# Altium schematic sheet A1-A1 Active Bias.SchDoc: A1-A1 Active Bias
size D; DrawnBy: C. Lewis; Engineer: C. Lewis; Address1: 4650 NORRIS CANYON RD.; Address2: SAN RAMON, CA 94583; DocumentNumber: 35133; Revision: D; SheetNumber: 4; SheetTotal: 20; PageSetup: Record=PageOptions|CenterHorizontal=True|CenterVertical=True|PrintScale=0.51|XCorrection=1.00|YCorrection=1.00|PrintKind=1|BorderSize=5000000|LeftOffset=0|BottomOffset=0|Orientation=2|PaperLength=1000|PaperWidth=1000|Scale=100|PaperSource=262|PrintQuality=600|MediaType=1|DitherType=10|PaperKind=11x17|PrintScaleMode=1
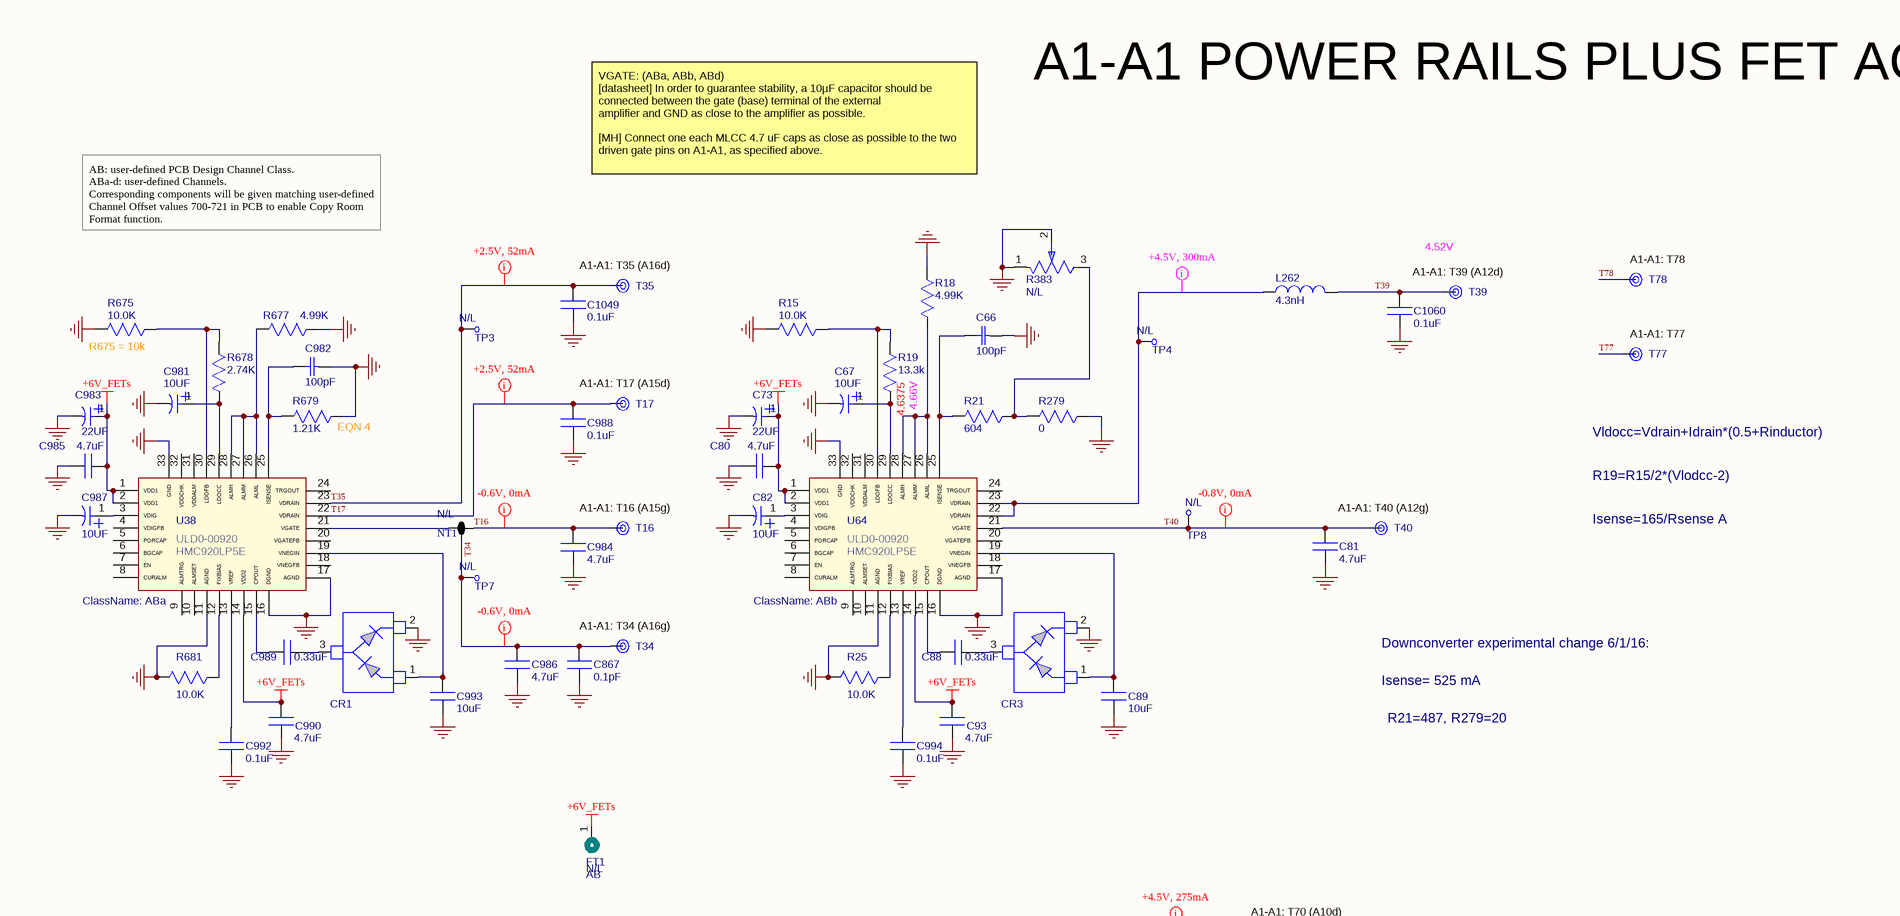
[diagram p0: A1-A1 Active Bias.SchDoc, top left]
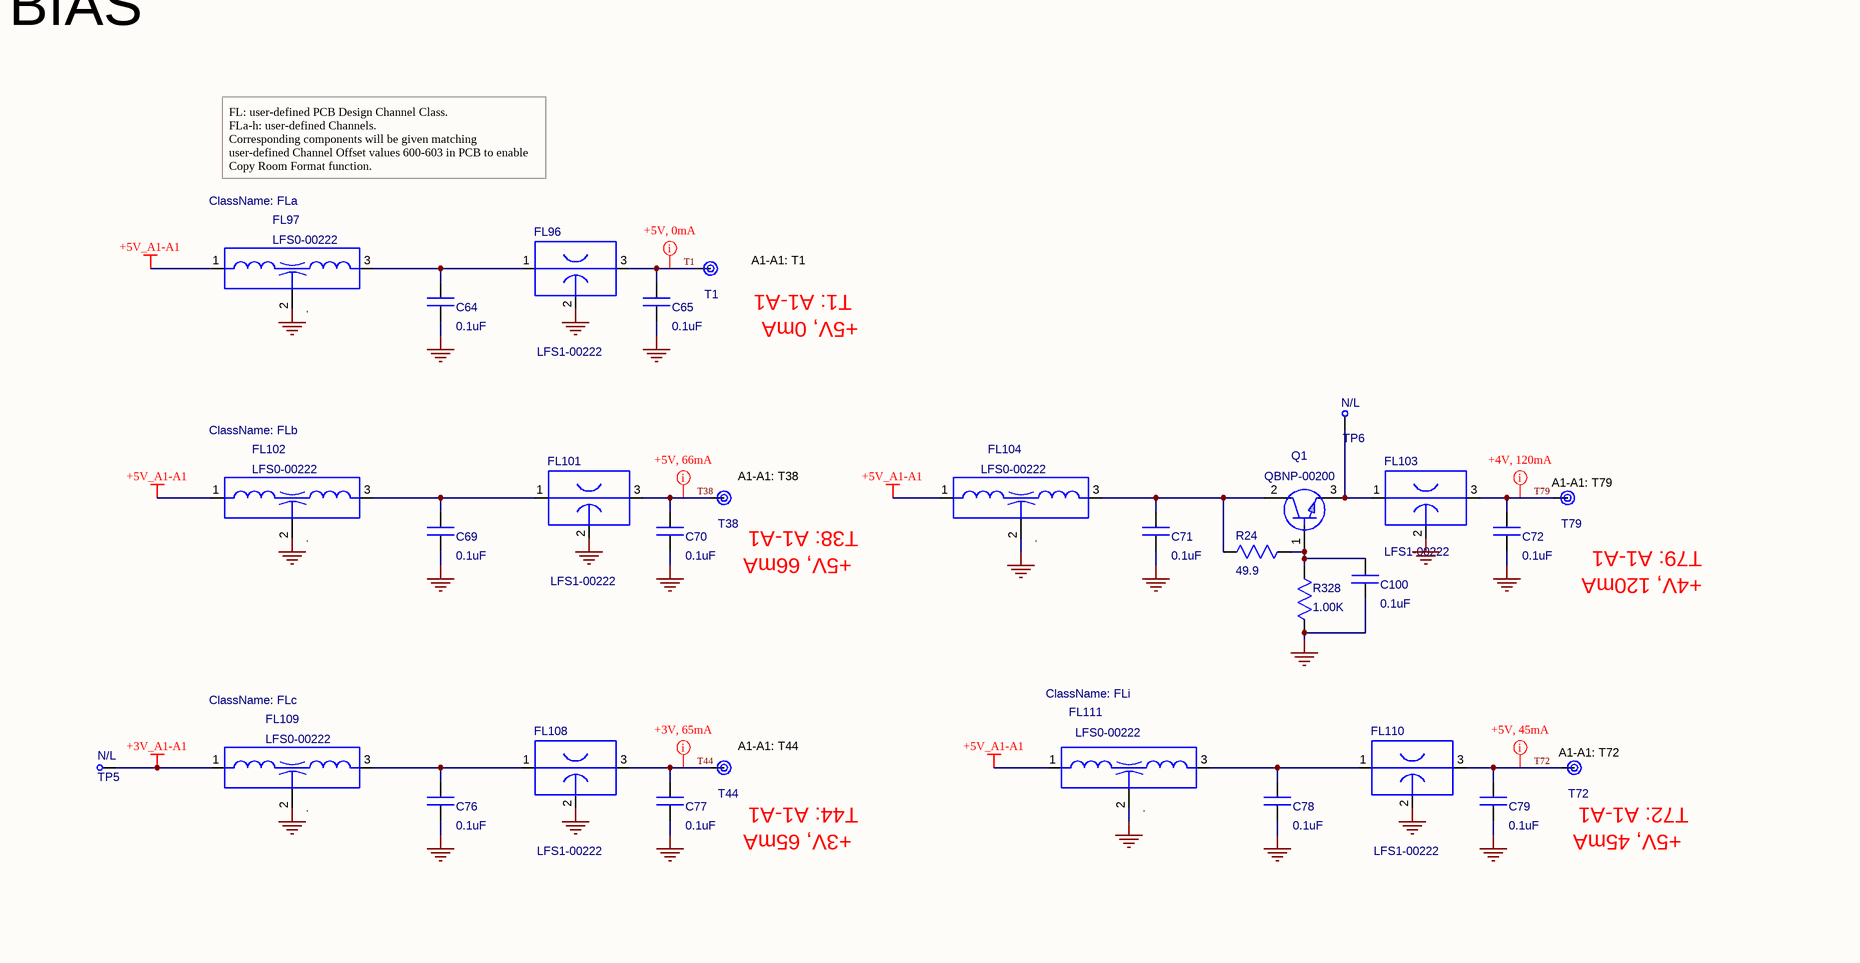
[diagram p1: A1-A1 Active Bias.SchDoc, top right]
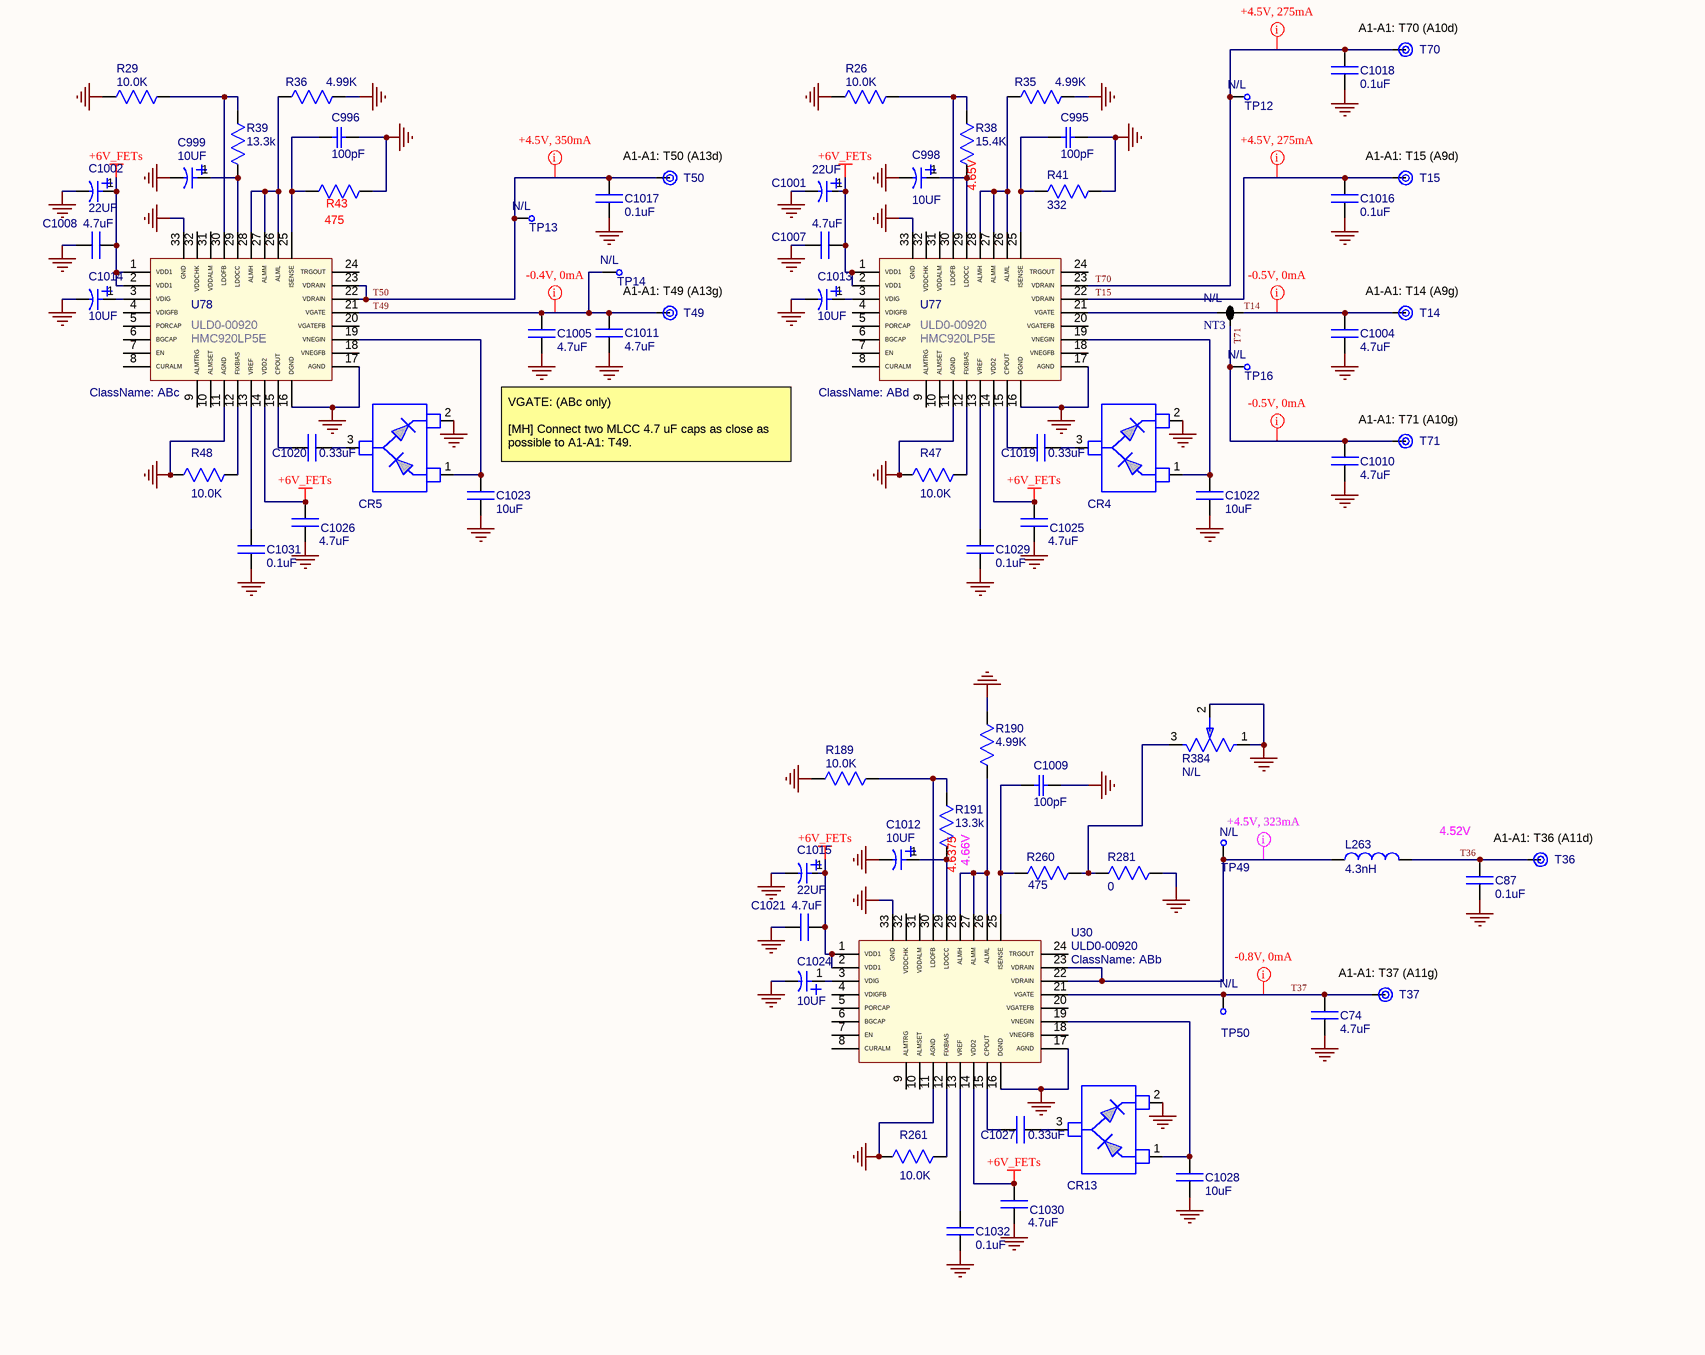
[diagram p2: A1-A1 Active Bias.SchDoc, bottom left]
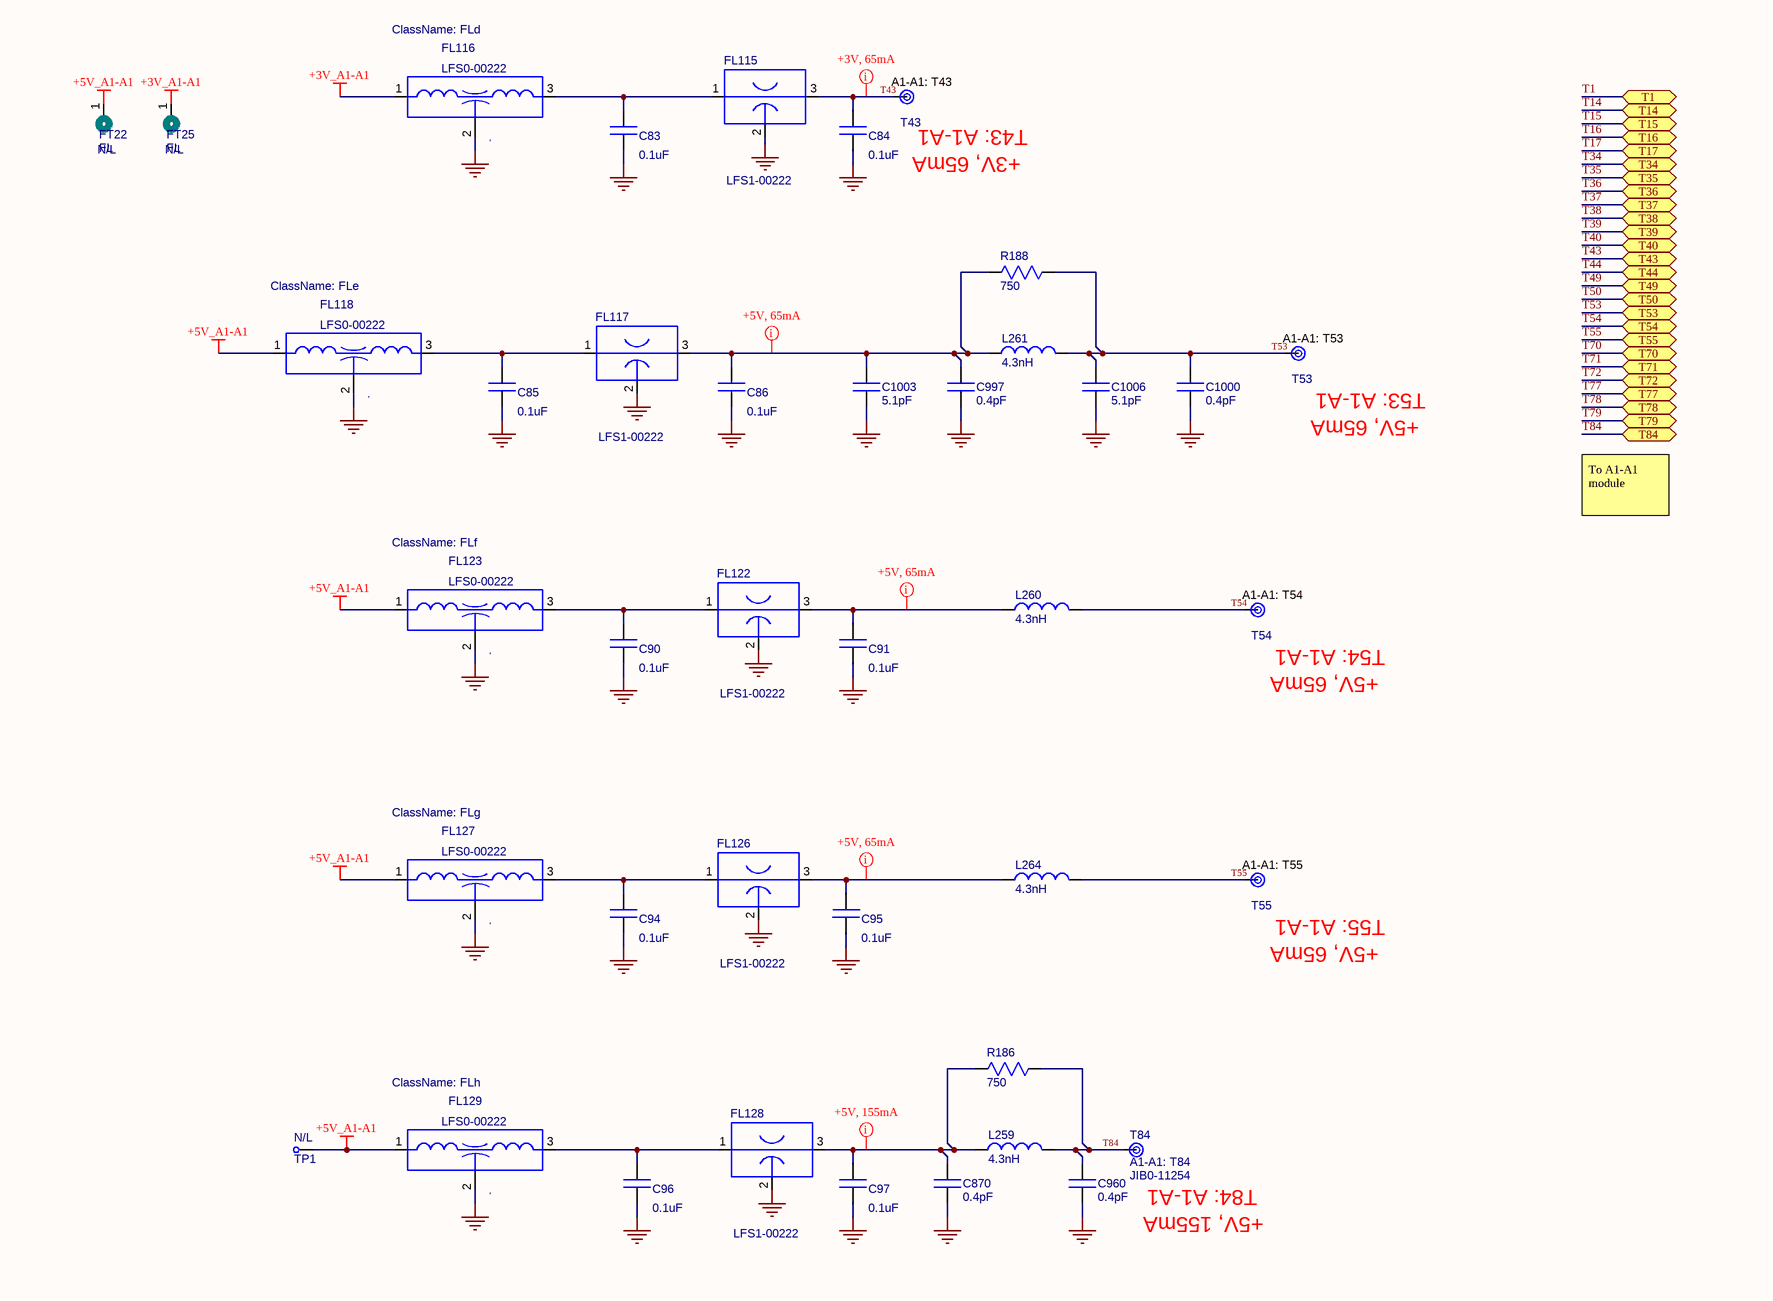
[diagram p3: A1-A1 Active Bias.SchDoc, bottom right]

## Parts
C64  value 0.1uF  [CAP-0603-H035-N]  (hidden comment: .1UF;10%;X7R;16V;CHIP;0603)
C65  value 0.1uF  [CAP-0603-H035-N]  (hidden comment: .1UF;10%;X7R;16V;CHIP;0603)
C66  value 100pF  [CC0603-P]  (hidden comment: CK45-01100[RF])
C67  10UF  [CAPP-3216-18]
C69  value 0.1uF  [CAP-0603-H035-N]  (hidden comment: .1UF;10%;X7R;16V;CHIP;0603)
C70  value 0.1uF  [CAP-0603-H035-N]  (hidden comment: .1UF;10%;X7R;16V;CHIP;0603)
C71  value 0.1uF  [CAP-0603-H035-N]  (hidden comment: .1UF;10%;X7R;16V;CHIP;0603)
C72  value 0.1uF  [CAP-0603-H035-N]  (hidden comment: .1UF;10%;X7R;16V;CHIP;0603)
C73  22UF  [CAPP-7343-31-N]
C74  value 4.7uF  [CAP-0402-N]  (hidden comment: 4.7 uF,10%;X5R;6.3V,CHIP;0402)
C76  value 0.1uF  [CAP-0603-H035-N]  (hidden comment: .1UF;10%;X7R;16V;CHIP;0603)
C77  value 0.1uF  [CAP-0603-H035-N]  (hidden comment: .1UF;10%;X7R;16V;CHIP;0603)
C78  value 0.1uF  [CAP-0603-H035-N]  (hidden comment: .1UF;10%;X7R;16V;CHIP;0603)
C79  value 0.1uF  [CAP-0603-H035-N]  (hidden comment: .1UF;10%;X7R;16V;CHIP;0603)
C80  value 4.7uF  [CAP-0805-N]  (hidden comment: 4.7uF 25V X5R CHIP CERAMIC)
C81  value 4.7uF  [CAP-0402-N]  (hidden comment: 4.7 uF,10%;X5R;6.3V,CHIP;0402)
C82  10UF  [CAPP-3216-18]
C83  value 0.1uF  [CAP-0603-H035-N]  (hidden comment: .1UF;10%;X7R;16V;CHIP;0603)
C84  value 0.1uF  [CAP-0603-H035-N]  (hidden comment: .1UF;10%;X7R;16V;CHIP;0603)
C85  value 0.1uF  [CAP-0603-H035-N]  (hidden comment: .1UF;10%;X7R;16V;CHIP;0603)
C86  value 0.1uF  [CAP-0603-H035-N]  (hidden comment: .1UF;10%;X7R;16V;CHIP;0603)
C87  value 0.1uF  [CAP-0603-H035-N]  (hidden comment: .1UF;10%;X7R;16V;CHIP;0603)
C88  value 0.33uF  [CAP-0805-N]  (hidden comment: .33 UF X7R CHIP CERAMIC)
C89  value 10uF  [CAP-0805-N]  (hidden comment: 10uF 16V X5R CHIP CERAMIC)
C90  value 0.1uF  [CAP-0603-H035-N]  (hidden comment: .1UF;10%;X7R;16V;CHIP;0603)
C91  value 0.1uF  [CAP-0603-H035-N]  (hidden comment: .1UF;10%;X7R;16V;CHIP;0603)
C93  value 4.7uF  [CAP-0805-N]  (hidden comment: 4.7uF 25V X5R CHIP CERAMIC)
C94  value 0.1uF  [CAP-0603-H035-N]  (hidden comment: .1UF;10%;X7R;16V;CHIP;0603)
C95  value 0.1uF  [CAP-0603-H035-N]  (hidden comment: .1UF;10%;X7R;16V;CHIP;0603)
C96  value 0.1uF  [CAP-0603-H035-N]  (hidden comment: .1UF;10%;X7R;16V;CHIP;0603)
C97  value 0.1uF  [CAP-0603-H035-N]  (hidden comment: .1UF;10%;X7R;16V;CHIP;0603)
C100  value 0.1uF  [CAP-0603-H035-N]  (hidden comment: .1UF;10%;X7R;16V;CHIP;0603)
C867  value 0.1pF  [CAP-0402-N]  (hidden comment: .1 PF;200V;.05PF;HIGH Q;SMT;CERAMIC;0402)
C870  value 0.4pF  [CAP-0402-RF]  (hidden comment: .4 PF;200V;.05PF;HIGH Q;SMT;CERAMIC;0402)
C960  value 0.4pF  [CAP-0402-RF]  (hidden comment: .4 PF;200V;.05PF;HIGH Q;SMT;CERAMIC;0402)
C981  10UF  [CAPP-3216-18]
C982  value 100pF  [CC0603-P]  (hidden comment: CK45-01100[RF])
C983  22UF  [CAPP-7343-31-N]
C984  value 4.7uF  [CAP-0402-N]  (hidden comment: 4.7 uF,10%;X5R;6.3V,CHIP;0402)
C985  value 4.7uF  [CAP-0805-N]  (hidden comment: 4.7uF 25V X5R CHIP CERAMIC)
C986  value 4.7uF  [CAP-0402-N]  (hidden comment: 4.7 uF,10%;X5R;6.3V,CHIP;0402)
C987  10UF  [CAPP-3216-18]
C988  value 0.1uF  [CAP-0603-H035-N]  (hidden comment: .1UF;10%;X7R;16V;CHIP;0603)
C989  value 0.33uF  [CAP-0805-N]  (hidden comment: .33 UF X7R CHIP CERAMIC)
C990  value 4.7uF  [CAP-0805-N]  (hidden comment: 4.7uF 25V X5R CHIP CERAMIC)
C992  value 0.1uF  [CAP-0603-H035-N]  (hidden comment: .1UF;10%;X7R;16V;CHIP;0603)
C993  value 10uF  [CAP-0805-N]  (hidden comment: 10uF 16V X5R CHIP CERAMIC)
C994  value 0.1uF  [CAP-0603-H035-N]  (hidden comment: .1UF;10%;X7R;16V;CHIP;0603)
C995  value 100pF  [CC0603-P]  (hidden comment: CK45-01100[RF])
C996  value 100pF  [CC0603-P]  (hidden comment: CK45-01100[RF])
C997  value 0.4pF  [CAP-0402-RF]  (hidden comment: .4 PF;200V;.05PF;HIGH Q;SMT;CERAMIC;0402)
C998  10UF  [CAPP-3216-18]
C999  10UF  [CAPP-3216-18]
C1000  value 0.4pF  [CAP-0402-RF]  (hidden comment: .4 PF;200V;.05PF;HIGH Q;SMT;CERAMIC;0402)
C1001  22UF  [CAPP-7343-31-N]
C1002  22UF  [CAPP-7343-31-N]
C1003  value 5.1pF  [CAP-0402-RF]  (hidden comment: 5.1 PF;200V;.1PF;HIGH Q;SMT;CERAMIC;0402)
C1004  value 4.7uF  [CAP-0402-N]  (hidden comment: 4.7 uF,10%;X5R;6.3V,CHIP;0402)
C1005  value 4.7uF  [CAP-0402-N]  (hidden comment: 4.7 uF,10%;X5R;6.3V,CHIP;0402)
C1006  value 5.1pF  [CAP-0402-RF]  (hidden comment: 5.1 PF;200V;.1PF;HIGH Q;SMT;CERAMIC;0402)
C1007  value 4.7uF  [CAP-0805-N]  (hidden comment: 4.7uF 25V X5R CHIP CERAMIC)
C1008  value 4.7uF  [CAP-0805-N]  (hidden comment: 4.7uF 25V X5R CHIP CERAMIC)
C1009  value 100pF  [CC0603-P]  (hidden comment: CK45-01100[RF])
C1010  value 4.7uF  [CAP-0402-N]  (hidden comment: 4.7 uF,10%;X5R;6.3V,CHIP;0402)
C1011  value 4.7uF  [CAP-0402-N]  (hidden comment: 4.7 uF,10%;X5R;6.3V,CHIP;0402)
C1012  10UF  [CAPP-3216-18]
C1013  10UF  [CAPP-3216-18]
C1014  10UF  [CAPP-3216-18]
C1015  22UF  [CAPP-7343-31-N]
C1016  value 0.1uF  [CAP-0603-H035-N]  (hidden comment: .1UF;10%;X7R;16V;CHIP;0603)
C1017  value 0.1uF  [CAP-0603-H035-N]  (hidden comment: .1UF;10%;X7R;16V;CHIP;0603)
C1018  value 0.1uF  [CAP-0603-H035-N]  (hidden comment: .1UF;10%;X7R;16V;CHIP;0603)
C1019  value 0.33uF  [CAP-0805-N]  (hidden comment: .33 UF X7R CHIP CERAMIC)
C1020  value 0.33uF  [CAP-0805-N]  (hidden comment: .33 UF X7R CHIP CERAMIC)
C1021  value 4.7uF  [CAP-0805-N]  (hidden comment: 4.7uF 25V X5R CHIP CERAMIC)
C1022  value 10uF  [CAP-0805-N]  (hidden comment: 10uF 16V X5R CHIP CERAMIC)
C1023  value 10uF  [CAP-0805-N]  (hidden comment: 10uF 16V X5R CHIP CERAMIC)
C1024  10UF  [CAPP-3216-18]
C1025  value 4.7uF  [CAP-0805-N]  (hidden comment: 4.7uF 25V X5R CHIP CERAMIC)
C1026  value 4.7uF  [CAP-0805-N]  (hidden comment: 4.7uF 25V X5R CHIP CERAMIC)
C1027  value 0.33uF  [CAP-0805-N]  (hidden comment: .33 UF X7R CHIP CERAMIC)
C1028  value 10uF  [CAP-0805-N]  (hidden comment: 10uF 16V X5R CHIP CERAMIC)
C1029  value 0.1uF  [CAP-0603-H035-N]  (hidden comment: .1UF;10%;X7R;16V;CHIP;0603)
C1030  value 4.7uF  [CAP-0805-N]  (hidden comment: 4.7uF 25V X5R CHIP CERAMIC)
C1031  value 0.1uF  [CAP-0603-H035-N]  (hidden comment: .1UF;10%;X7R;16V;CHIP;0603)
C1032  value 0.1uF  [CAP-0603-H035-N]  (hidden comment: .1UF;10%;X7R;16V;CHIP;0603)
C1049  value 0.1uF  [CAP-0603-H035-N]  (hidden comment: .1UF;10%;X7R;16V;CHIP;0603)
C1060  value 0.1uF  [CAP-0603-H035-N]  (hidden comment: .1UF;10%;X7R;16V;CHIP;0603)
CR1  Diode;Dual;Schottky;.4VF@10MA;5NS;SOT23  [SOT23-N]  (value not drawn)
CR3  Diode;Dual;Schottky;.4VF@10MA;5NS;SOT23  [SOT23-N]  (value not drawn)
CR4  Diode;Dual;Schottky;.4VF@10MA;5NS;SOT23  [SOT23-N]  (value not drawn)
CR5  Diode;Dual;Schottky;.4VF@10MA;5NS;SOT23  [SOT23-N]  (value not drawn)
CR13  Diode;Dual;Schottky;.4VF@10MA;5NS;SOT23  [SOT23-N]  (value not drawn)
FL96  NFM18CC222R1C3  [FIL-NFL18C]  (value not drawn)
FL97  ClassName: FLa  [FIL-NFE31P-1206-4P]  (hidden comment: Filter EMI 2200PF,1206)
FL101  NFM18CC222R1C3  [FIL-NFL18C]  (value not drawn)
FL102  ClassName: FLb  [FIL-NFE31P-1206-4P]  (hidden comment: Filter EMI 2200PF,1206)
FL103  NFM18CC222R1C3  [FIL-NFL18C]  (value not drawn)
FL104  Filter EMI 2200PF,1206  [FIL-NFE31P-1206-4P]  (value not drawn)
FL108  NFM18CC222R1C3  [FIL-NFL18C]  (value not drawn)
FL109  ClassName: FLc  [FIL-NFE31P-1206-4P]  (hidden comment: Filter EMI 2200PF,1206)
FL110  NFM18CC222R1C3  [FIL-NFL18C]  (value not drawn)
FL111  ClassName: FLi  [FIL-NFE31P-1206-4P]  (hidden comment: Filter EMI 2200PF,1206)
FL115  NFM18CC222R1C3  [FIL-NFL18C]  (value not drawn)
FL116  ClassName: FLd  [FIL-NFE31P-1206-4P]  (hidden comment: Filter EMI 2200PF,1206)
FL117  NFM18CC222R1C3  [FIL-NFL18C]  (value not drawn)
FL118  ClassName: FLe  [FIL-NFE31P-1206-4P]  (hidden comment: Filter EMI 2200PF,1206)
FL122  NFM18CC222R1C3  [FIL-NFL18C]  (value not drawn)
FL123  ClassName: FLf  [FIL-NFE31P-1206-4P]  (hidden comment: Filter EMI 2200PF,1206)
FL126  NFM18CC222R1C3  [FIL-NFL18C]  (value not drawn)
FL127  ClassName: FLg  [FIL-NFE31P-1206-4P]  (hidden comment: Filter EMI 2200PF,1206)
FL128  NFM18CC222R1C3  [FIL-NFL18C]  (value not drawn)
FL129  ClassName: FLh  [FIL-NFE31P-1206-4P]  (hidden comment: Filter EMI 2200PF,1206)
FT1  AB  NoLoad: N/L  [FromToNode_ML2]  (net tie, no BOM)
FT22  FL  NoLoad: N/L  [FromToNode_ML2]  (net tie, no BOM)
FT25  FL  NoLoad: N/L  [FromToNode_ML2]  (net tie, no BOM)
L259  value 4.3nH  [IND-0402HP]  (hidden comment: INDUCTOR;4.3NH;2%;7.15GHZ SRF;90Q @1.7GHZ;.050 DCR;1.6A;0402)
L260  value 4.3nH  [IND-0402HP]  (hidden comment: INDUCTOR;4.3NH;2%;7.15GHZ SRF;90Q @1.7GHZ;.050 DCR;1.6A;0402)
L261  value 4.3nH  [IND-0402HP]  (hidden comment: INDUCTOR;4.3NH;2%;7.15GHZ SRF;90Q @1.7GHZ;.050 DCR;1.6A;0402)
L262  value 4.3nH  [IND-0402HP]  (hidden comment: INDUCTOR;4.3NH;2%;7.15GHZ SRF;90Q @1.7GHZ;.050 DCR;1.6A;0402)
L263  value 4.3nH  [IND-0402HP]  (hidden comment: INDUCTOR;4.3NH;2%;7.15GHZ SRF;90Q @1.7GHZ;.050 DCR;1.6A;0402)
L264  value 4.3nH  [IND-0402HP]  (hidden comment: INDUCTOR;4.3NH;2%;7.15GHZ SRF;90Q @1.7GHZ;.050 DCR;1.6A;0402)
NT1  NoLoad: N/L  [3wayT_LP]  (hidden comment: 3 way net tie junction T shape)  (net tie, no BOM)
NT3  NoLoad: N/L  [3wayT_LP]  (hidden comment: 3 way net tie junction T shape)  (net tie, no BOM)
Q1  5A;25V VCEO;12.5W;45 MIN HFE;DPAK  [TO-252_DPAK_REVA]  (value not drawn)
R15  value 10.0K  [RES-0402-N]  (hidden comment: 10.0K OHMS;.06W;1%;200PPM;FILM;CHIP;0402)
R18  value 4.99K  [RES-0402-N]  (hidden comment: 4.99K OHMS;.06W;1%;200PPM;FILM;CHIP;0402)
R19  value 13.3k  [RES-0402-N]  (hidden comment: 13.3K OHMS;.06W;1%;200PPM;FILM;CHIP;0402)
R21  value 604  [RES-0402-N]  (hidden comment: 604 OHMS; 1%; .1W; 100PPM; FILM; CHIP; 0402)
R24  value 49.9  [RES-0603-N]  (hidden comment: 49.9 OHMS; 1%; .1W; 100PPM; FILM; CHIP; 0603)
R25  value 10.0K  [RES-0402-N]  (hidden comment: 10.0K Ohms;.06W;0.5%;±50PPM;CHIP RES;0402)
R26  value 10.0K  [RES-0402-N]  (hidden comment: 10.0K OHMS;.06W;1%;200PPM;FILM;CHIP;0402)
R29  value 10.0K  [RES-0402-N]  (hidden comment: 10.0K OHMS;.06W;1%;200PPM;FILM;CHIP;0402)
R35  value 4.99K  [RES-0402-N]  (hidden comment: 4.99K OHMS;.06W;1%;200PPM;FILM;CHIP;0402)
R36  value 4.99K  [RES-0402-N]  (hidden comment: 4.99K OHMS;.06W;1%;200PPM;FILM;CHIP;0402)
R38  value 15.4K  [RES-0402-N]  (hidden comment: 15.4K OHMS;.06W;1%;200PPM;FILM;CHIP;0402)
R39  value 13.3k  [RES-0402-N]  (hidden comment: 13.3K OHMS;.06W;1%;200PPM;FILM;CHIP;0402)
R41  value 332  [RES-0402-N]  (hidden comment: 332 OHMS; 1%; .1W; 100PPM; FILM; CHIP)
R43  value 475  [RES-0402-N]  (hidden comment: 475 OHMS; 1%; .1W; 100PPM; FILM; CHIP; 0402)
R47  value 10.0K  [RES-0402-N]  (hidden comment: 10.0K Ohms;.06W;0.5%;±50PPM;CHIP RES;0402)
R48  value 10.0K  [RES-0402-N]  (hidden comment: 10.0K Ohms;.06W;0.5%;±50PPM;CHIP RES;0402)
R186  value 750  [RES-0201-N]  (hidden comment: 750 OHMS;.05W;1%;100PPM;FILM CHIP;0201)
R188  value 750  [RES-0201-N]  (hidden comment: 750 OHMS;.05W;1%;100PPM;FILM CHIP;0201)
R189  value 10.0K  [RES-0402-N]  (hidden comment: 10.0K OHMS;.06W;1%;200PPM;FILM;CHIP;0402)
R190  value 4.99K  [RES-0402-N]  (hidden comment: 4.99K OHMS;.06W;1%;200PPM;FILM;CHIP;0402)
R191  value 13.3k  [RES-0402-N]  (hidden comment: 13.3K OHMS;.06W;1%;200PPM;FILM;CHIP;0402)
R260  value 475  [RES-0402-N]  (hidden comment: 475 OHMS; 1%; .1W; 100PPM; FILM; CHIP; 0402)
R261  value 10.0K  [RES-0402-N]  (hidden comment: 10.0K Ohms;.06W;0.5%;±50PPM;CHIP RES;0402)
R279  value 0  [RES-0402-N]  (hidden comment: JUMPER;0 OHMS;SMT;0402)
R281  value 0  [RES-0402-N]  (hidden comment: JUMPER;0 OHMS;SMT;0402)
R328  value 1.00K  [RES-0402-N]  (hidden comment: 1.0K OHMS;.06W;1%;200PPM;FILM;CHIP;0402)
R383  NoLoad: N/L  [TRIM-PVA2]  (hidden comment: 220 OHM; 25%; 1T; SMT; 2.75MMx2.2MM; TOP ADJ)
R384  NoLoad: N/L  [TRIM-PVA2]  (hidden comment: 220 OHM; 25%; 1T; SMT; 2.75MMx2.2MM; TOP ADJ)
R675  value 10.0K  [RES-0402-N]  (hidden comment: 10.0K OHMS;.06W;1%;200PPM;FILM;CHIP;0402)
R677  value 4.99K  [RES-0402-N]  (hidden comment: 4.99K OHMS;.06W;1%;200PPM;FILM;CHIP;0402)
R678  value 2.74K  [RES-0402-N]  (hidden comment: 2.74K OHMS;.06W;1%;100PPM;FILM;CHIP;0402)
R679  value 1.21K  [RES-0402-N]  (hidden comment: 1.21K OHMS;.06W;1%;200PPM;FILM;CHIP;0402)
R681  value 10.0K  [RES-0402-N]  (hidden comment: 10.0K Ohms;.06W;0.5%;±50PPM;CHIP RES;0402)
T1  A1-A1: T1  [JIB0-11254]
T14  A1-A1: T14 (A9g)  [JIB0-11254]
T15  A1-A1: T15 (A9d)  [JIB0-11254]
T16  A1-A1: T16 (A15g)  [JIB0-11254]
T17  A1-A1: T17 (A15d)  [JIB0-11254]
T34  A1-A1: T34 (A16g)  [JIB0-11254]
T35  A1-A1: T35 (A16d)  [JIB0-11254]
T36  A1-A1: T36 (A11d)  [JIB0-11254]
T37  A1-A1: T37 (A11g)  [JIB0-11254]
T38  A1-A1: T38  [JIB0-11254]
T39  A1-A1: T39 (A12d)  [JIB0-11254]
T40  A1-A1: T40 (A12g)  [JIB0-11254]
T43  A1-A1: T43  [JIB0-11254]
T44  A1-A1: T44  [JIB0-11254]
T49  A1-A1: T49 (A13g)  [JIB0-11254]
T50  A1-A1: T50 (A13d)  [JIB0-11254]
T53  A1-A1: T53  [JIB0-11254]
T54  A1-A1: T54  [JIB0-11254]
T55  A1-A1: T55  [JIB0-11254]
T70  A1-A1: T70 (A10d)  [JIB0-11254]
T71  A1-A1: T71 (A10g)  [JIB0-11254]
T72  A1-A1: T72  [JIB0-11254]
T77  A1-A1: T77  [JIB0-11254]
T78  A1-A1: T78  [JIB0-11254]
T79  A1-A1: T79  [JIB0-11254]
T84  A1-A1: T84  G_PN: JIB0-11254  [JIB0-11254-TRIM]
TP1  NoLoad: N/L  [TP-060]  (hidden comment: .)
TP3  NoLoad: N/L  [TP-060]  (hidden comment: .)
TP4  NoLoad: N/L  [TP-060]  (hidden comment: .)
TP5  NoLoad: N/L  [TP-060]  (hidden comment: .)
TP6  NoLoad: N/L  [TP-060]  (hidden comment: .)
TP7  NoLoad: N/L  [TP-060]  (hidden comment: .)
TP8  NoLoad: N/L  [TP-060]  (hidden comment: .)
TP12  NoLoad: N/L  [TP-060]  (hidden comment: .)
TP13  NoLoad: N/L  [TP-060]  (hidden comment: .)
TP14  NoLoad: N/L  [TP-060]  (hidden comment: .)
TP16  NoLoad: N/L  [TP-060]  (hidden comment: .)
TP49  NoLoad: N/L  [TP-060]  (hidden comment: .)
TP50  NoLoad: N/L  [TP-060]  (hidden comment: .)
U30  G_PN: ULD0-00920  ClassName: ABb  [LP5E_HITTITE_NO_VIAS]  (hidden comment: ULD0-00920_1)
U38  M_PN: HMC920LP5E  ClassName: ABa  [LP5E_HITTITE]  (hidden comment: ULD0-00920)
U64  M_PN: HMC920LP5E  ClassName: ABb  [LP5E_HITTITE]  (hidden comment: ULD0-00920)
U77  M_PN: HMC920LP5E  ClassName: ABd  [LP5E_HITTITE]  (hidden comment: ULD0-00920)
U78  M_PN: HMC920LP5E  ClassName: ABc  [LP5E_HITTITE]  (hidden comment: ULD0-00920)

## Ports
T1, T14, T15, T16, T17, T34, T35, T36, T37, T38, T39, T40, T43, T44, T49, T50, T53, T54, T55, T70, T71, T72, T77, T78, T79, T84

## Nets
+3V_A1-A1: FL109.1(IN) FL116.1(IN) FT25.1 TP5.1
+5V_A1-A1: FL97.1(IN) FL102.1(IN) FL104.1(IN) FL111.1(IN) FL118.1(IN) FL123.1(IN) FL127.1(IN) FL129.1(IN) FT22.1 TP1.1
+6V_FETs: C73.1(POS) C80.2 C93.2 C983.1(POS) C985.2 C990.2 C1001.1(POS) C1002.1(POS) C1007.2 C1008.2 C1015.1(POS) C1021.2 C1025.2 C1026.2 C1030.2 FT1.1 U30.1(VDD1) U30.2(VDD1) U30.14(VDD2) U38.1(VDD1) U38.2(VDD1) U38.14(VDD2) U64.1(VDD1) U64.2(VDD1) U64.14(VDD2) U77.1(VDD1) U77.2(VDD1) U77.14(VDD2) U78.1(VDD1) U78.2(VDD1) U78.14(VDD2)
GND: C64.2 C65.2 C66.2 C67.2(NEG) C69.2 C70.2 C71.2 C72.2 C73.2(NEG) C74.1 C76.2 C77.2 C78.2 C79.2 C80.1 C81.2 C82.2(NEG) C83.2 C84.2 C85.2 C86.2 C87.1 C89.1 C90.2 C91.2 C93.1 C94.2 C95.2 C96.2 C97.2 C100.1 C867.2 C870.2 C960.2 C981.2(NEG) C982.2 C983.2(NEG) C984.1 C985.1 C986.2 C987.2(NEG) C988.1 C990.1 C992.1 C993.1 C994.1 C995.2 C996.2 C997.2 C998.2(NEG) C999.2(NEG) C1000.2 C1001.2(NEG) C1002.2(NEG) C1003.2 C1004.1 C1005.1 C1006.2 C1007.1 C1008.1 C1009.2 C1010.2 C1011.2 C1012.2(NEG) C1013.2(NEG) C1014.2(NEG) C1015.2(NEG) C1016.1 C1017.1 C1018.1 C1021.1 C1022.1 C1023.1 C1024.2(NEG) C1025.1 C1026.1 C1028.1 C1029.1 C1030.1 C1031.1 C1032.1 C1049.1 C1060.1 CR1.2(k2) CR3.2(k2) CR4.2(k2) CR5.2(k2) CR13.2(k2) FL96.2 FL97.2(GND) FL101.2 FL102.2(GND) FL103.2 FL104.2(GND) FL108.2 FL109.2(GND) FL110.2 FL111.2(GND) FL115.2 FL116.2(GND) FL117.2 FL118.2(GND) FL122.2 FL123.2(GND) FL126.2 FL127.2(GND) FL128.2 FL129.2(GND) R15.1 R18.2 R25.1 R26.1 R29.1 R35.2 R36.2 R41.2 R43.2 R47.1 R48.1 R189.1 R190.2 R261.1 R279.2 R281.2 R328.1 R383.1 R383.2 R384.1 R384.2 R675.1 R677.2 R679.2 R681.1 U30.11(AGND) U30.16(DGND) U30.17(AGND) U30.33(GND) U38.11(AGND) U38.16(DGND) U38.17(AGND) U38.33(GND) U64.11(AGND) U64.16(DGND) U64.17(AGND) U64.33(GND) U77.11(AGND) U77.16(DGND) U77.17(AGND) U77.33(GND) U78.11(AGND) U78.16(DGND) U78.17(AGND) U78.33(GND)
T1: C65.1 FL96.3 T1.1 ; port T1
T14: C1004.2 NT3.2 T14.1 ; port T14
T15: C1016.2 T15.1 U77.22(VDRAIN) ; port T15
T16: C984.2 NT1.2 T16.1 ; port T16
T17: C988.2 T17.1 U38.22(VDRAIN) ; port T17
T34: C867.1 C986.1 NT1.1 T34.1 TP7.1 ; port T34
T35: C1049.2 T35.1 TP3.1 U38.23(VDRAIN) ; port T35
T36: C87.2 L263.2 T36.1 ; port T36
T37: C74.2 T37.1 TP50.1 U30.21(VGATE) ; port T37
T38: C70.1 FL101.3 T38.1 ; port T38
T39: C1060.2 L262.2 T39.1 ; port T39
T40: C81.1 T40.1 TP8.1 U64.21(VGATE) ; port T40
T43: C84.1 FL115.3 T43.1 ; port T43
T44: C77.1 FL108.3 T44.1 ; port T44
T49: C1005.2 C1011.1 T49.1 TP14.1 U78.21(VGATE) ; port T49
T50: C1017.2 T50.1 TP13.1 U78.22(VDRAIN) U78.23(VDRAIN) ; port T50
T53: C1000.1 C1006.1 L261.2 R188.2 T53.1 ; port T53
T54: L260.2 T54.1 ; port T54
T55: L264.2 T55.1 ; port T55
T70: C1018.2 T70.1 TP12.1 U77.23(VDRAIN) ; port T70
T71: C1010.1 NT3.1 T71.1 TP16.1 ; port T71
T72: C79.1 FL110.3 T72.1 ; port T72
T77: T77.1 ; port T77
T78: T78.1 ; port T78
T79: C72.1 FL103.3 T79.1 ; port T79
T84: C960.1 L259.2 R186.2 T84.1 ; port T84
NetC64_1: C64.1 FL96.1 FL97.3(OUT)
NetC66_1: C66.1 R21.1 U64.25(ISENSE)
NetC67_1: C67.1(POS) R19.1 U64.29(LDOCC)
NetC69_1: C69.1 FL101.1 FL102.3(OUT)
NetC71_1: C71.1 FL104.3(OUT) Q1.2(COLLECTOR) R24.1
NetC76_1: C76.1 FL108.1 FL109.3(OUT)
NetC78_1: C78.1 FL110.1 FL111.3(OUT)
NetC82_1: C82.1(POS) U64.3(VDIG)
NetC83_1: C83.1 FL115.1 FL116.3(OUT)
NetC85_1: C85.1 FL117.1 FL118.3(OUT)
NetC86_1: C86.1 C997.1 C1003.1 FL117.3 L261.1 R188.1
NetC88_1: C88.1 U64.15(CPOUT)
NetC88_2: C88.2 CR3.3(k1,a2)
NetC89_2: C89.2 CR3.1(a1) U64.19(VNEGIN)
NetC90_1: C90.1 FL122.1 FL123.3(OUT)
NetC91_1: C91.1 FL122.3 L260.1
NetC94_1: C94.1 FL126.1 FL127.3(OUT)
NetC95_1: C95.1 FL126.3 L264.1
NetC96_1: C96.1 FL128.1 FL129.3(OUT)
NetC97_1: C97.1 C870.1 FL128.3 L259.1 R186.1
NetC100_2: C100.2 Q1.1(BASE) R24.2 R328.2
NetC981_1: C981.1(POS) R678.1 U38.29(LDOCC)
NetC982_1: C982.1 R679.1 U38.25(ISENSE)
NetC987_1: C987.1(POS) U38.3(VDIG)
NetC989_1: C989.1 U38.15(CPOUT)
NetC989_2: C989.2 CR1.3(k1,a2)
NetC992_2: C992.2 U38.13(VREF)
NetC993_2: C993.2 CR1.1(a1) U38.19(VNEGIN)
NetC994_2: C994.2 U64.13(VREF)
NetC995_1: C995.1 R41.1 U77.25(ISENSE)
NetC996_1: C996.1 R43.1 U78.25(ISENSE)
NetC998_1: C998.1(POS) R38.1 U77.29(LDOCC)
NetC999_1: C999.1(POS) R39.1 U78.29(LDOCC)
NetC1009_1: C1009.1 R260.1 U30.25(ISENSE)
NetC1012_1: C1012.1(POS) R191.1 U30.29(LDOCC)
NetC1013_1: C1013.1(POS) U77.3(VDIG)
NetC1014_1: C1014.1(POS) U78.3(VDIG)
NetC1019_1: C1019.1 U77.15(CPOUT)
NetC1019_2: C1019.2 CR4.3(k1,a2)
NetC1020_1: C1020.1 U78.15(CPOUT)
NetC1020_2: C1020.2 CR5.3(k1,a2)
NetC1022_2: C1022.2 CR4.1(a1) U77.19(VNEGIN)
NetC1023_2: C1023.2 CR5.1(a1) U78.19(VNEGIN)
NetC1024_1: C1024.1(POS) U30.3(VDIG)
NetC1027_1: C1027.1 U30.15(CPOUT)
NetC1027_2: C1027.2 CR13.3(k1,a2)
NetC1028_2: C1028.2 CR13.1(a1) U30.19(VNEGIN)
NetC1029_2: C1029.2 U77.13(VREF)
NetC1031_2: C1031.2 U78.13(VREF)
NetC1032_2: C1032.2 U30.13(VREF)
NetFL103_1: FL103.1 Q1.3(EMITTER) TP6.1
NetL262_1: L262.1 TP4.1 U64.22(VDRAIN) U64.23(VDRAIN)
NetL263_1: L263.1 TP49.1 U30.22(VDRAIN) U30.23(VDRAIN)
NetNT1_3: NT1.3 U38.21(VGATE)
NetNT3_3: NT3.3 U77.21(VGATE)
NetR15_2: R15.2 R19.2 U64.30(LDOFB)
NetR18_1: R18.1 U64.26(ALML) U64.27(ALMM) U64.28(ALMH)
NetR21_2: R21.2 R279.1 R383.3
NetR25_2: R25.2 U64.12(FIXBIAS)
NetR26_2: R26.2 R38.2 U77.30(LDOFB)
NetR29_2: R29.2 R39.2 U78.30(LDOFB)
NetR35_1: R35.1 U77.26(ALML) U77.27(ALMM) U77.28(ALMH)
NetR36_1: R36.1 U78.26(ALML) U78.27(ALMM) U78.28(ALMH)
NetR47_2: R47.2 U77.12(FIXBIAS)
NetR48_2: R48.2 U78.12(FIXBIAS)
NetR189_2: R189.2 R191.2 U30.30(LDOFB)
NetR190_1: R190.1 U30.26(ALML) U30.27(ALMM) U30.28(ALMH)
NetR260_2: R260.2 R281.1 R384.3
NetR261_2: R261.2 U30.12(FIXBIAS)
NetR675_2: R675.2 R678.2 U38.30(LDOFB)
NetR677_1: R677.1 U38.26(ALML) U38.27(ALMM) U38.28(ALMH)
NetR681_2: R681.2 U38.12(FIXBIAS)

Not connected (* = marked no-connect by the designer): U30 4(VDIGFB) 5(PORCAP) 6(BGCAP) 7(EN) 8(CURALM) 9(ALMTRG) 10(ALMSET) 18(VNEGFB) 20(VGATEFB) 24(TRGOUT) 31(VDDALM) 32(VDDCHK); U38 4(VDIGFB) 5(PORCAP) 6(BGCAP) 7(EN) 8(CURALM) 9(ALMTRG) 10(ALMSET) 18(VNEGFB) 20(VGATEFB) 24(TRGOUT) 31(VDDALM) 32(VDDCHK); U64 4(VDIGFB) 5(PORCAP) 6(BGCAP) 7(EN) 8(CURALM) 9(ALMTRG) 10(ALMSET) 18(VNEGFB) 20(VGATEFB) 24(TRGOUT) 31(VDDALM) 32(VDDCHK); U77 4(VDIGFB) 5(PORCAP) 6(BGCAP) 7(EN) 8(CURALM) 9(ALMTRG) 10(ALMSET) 18(VNEGFB) 20(VGATEFB) 24(TRGOUT) 31(VDDALM) 32(VDDCHK); U78 4(VDIGFB) 5(PORCAP) 6(BGCAP) 7(EN) 8(CURALM) 9(ALMTRG) 10(ALMSET) 18(VNEGFB) 20(VGATEFB) 24(TRGOUT) 31(VDDALM) 32(VDDCHK)

## Layout directives
net class -0.8V, 0mA: T37, T40
net class -0.6V, 0mA: T16, T34
net class -0.5V, 0mA: T14, T71
net class -0.4V, 0mA: T49
net class +2.5V, 52mA: T17, T35
net class +3V, 65mA: T43, T44
net class +4V, 120mA: T79
net class +4.5V, 250mA: NetL262_1, NetL263_1
net class +4.5V, 300mA: T15, T70
net class +4.5V, 416mA: T50
net class +5V, 45mA: T72
net class +5V, 65mA: NetC86_1, NetC91_1, NetC95_1
net class +5V, 0mA: T1
net class +5V, 66mA: T38
net class +5V, 155mA: NetC97_1

## Notes on the sheet
- A1-A1 POWER RAILS PLUS FET ACTIVE BIAS
- VGATE: (ABa, ABb, ABd)
  [datasheet] In order to guarantee stability, a 10µF capacitor should be
  connected between the gate (base) terminal of the external
  amplifier and GND as close to the amplifier as possible.
  [MH] Connect one each MLCC 4.7 uF caps as close as possible to the two
  driven gate pins on A1-A1, as specified above.
- AB: user-defined PCB Design Channel Class.
  ABa-d: user-defined Channels.
  Corresponding components will be given matching user-defined Channel Offset values 700-721 in PCB to enable Copy Room Format function.
- 4.52V
- FL: user-defined PCB Design Channel Class.
  FLa-h: user-defined Channels.
  Corresponding components will be given matching user-defined Channel Offset values 600-603 in PCB to enable Copy Room Format function.
- (near T1) T1: A1-A1
- (near R675) R675 = 10k
- +5V, 0mA
- (near R679) EQN 4
- (near R19) 4.6375
- (near R19) 4.66V
- Vldocc=Vdrain+Idrain*(0.5+Rinductor)
- R19=R15/2*(Vlodcc-2)
- Isense=165/Rsense A
- +5V, 66mA
- (near T38) T38: A1-A1
- (near T79) T79: A1-A1
- +4V, 120mA
- Downconverter experimental change 6/1/16:
- Isense= 525 mA
- R21=487, R279=20
- +3V, 65mA
- (near T44) T44: A1-A1
- +5V, 45mA
- (near T72) T72: A1-A1
- (near R38) 4.65V
- (near T43) T43: A1-A1
- VGATE: (ABc only)
  [MH] Connect two MLCC 4.7 uF caps as close as
  possible to A1-A1: T49.
- +5V, 65mA
- (near T53) T53: A1-A1
- To A1-A1 module
- (near T54) T54: A1-A1
- (near R191) 4.6375
- (near R191) 4.66V
- (near T55) T55: A1-A1
- (near T84) T84: A1-A1
- +5V, 155mA
- Title
- Sheet Title
- PRINTED DOCUMENT IS CONSIDERED UNCONTROLLED. VERIFY REVISION IN PLM SYSTEM.
- THIS DOCUMENT CONTAINS PROPRIETARY INFORMATION. DESIGN RIGHTS BELONG TO GIGA-TRONICS AND MAY NOT BE REPRODUCED WITHOUT WRITTEN AUTHORIZATION FOR ANY REASON EXCEPT CALIBRATION, OPERATION AND MAINTENANCE.
- Size
- CAGE CODE
- Filename
- D
- Document Number
- 58900
- Date
- Sheet
- Rev
- of
- (in symbol LFS0-00222) ,

## Library data of the parts
C64 C65 C69-C72 C76-C79 C83-C87 C90 C91 C94-C97 C100 C988 C992 C994 C1016-C1018 C1029 C1031 C1032 C1049 C1060 = CK45-04100: Approved: CL; NoLoad: .; MFGR: ANY; level: 1; line_number: 105; ModifyDate: 02/22/12; G_PN: CK45-04100; M_PN: ANY; item_number: CK45-04100
  C64 C65: ClassName: FLa
  C69 C70: ClassName: FLb
  C76 C77: ClassName: FLc
  C78 C79: ClassName: FLi
  C83 C84: ClassName: FLd
  C85 C86: ClassName: FLe
  C87 C988 C1016-C1018 C1049 C1060: ClassName: A1-A1
  C90 C91: ClassName: FLf
  C94 C95: ClassName: FLg
  C96 C97: ClassName: FLh
  C992: ClassName: ABa
  C994 C1032: ClassName: ABb
  C1029: ClassName: ABd
  C1031: ClassName: ABc
C66 C982 C995 C996 C1009 = CK45-01100[RF]: 100 PF;5%;COG;>50V;CHIP;0603; RF footprint; Approved: NB; NoLoad: .; level: 1; line_number: 115; G_PN: CK45-01100; ModifyDate: 02/14/2008 14:07:19; item_number: CK45-01100
  C66 C1009: ClassName: ABb
  C982: ClassName: ABa
  C995: ClassName: ABd
  C996: ClassName: ABc
C67 C82 C981 C987 C998 C999 C1012-C1014 C1024 = CT10-S6100: 10 UF;10%;10V;3.4 OHM ESR;3216; Approved: XiaoXiao; NoLoad: .; MFGR: ANY; level: 1; line_number: 125; ModifyDate: 12/03/2012; M_PN: ANY; G_PN: CT10-S6100; Value: 10UF; item_number: CT10-S6100
  C67 C82 C1012 C1024: ClassName: ABb
  C981 C987: ClassName: ABa
  C998 C1013: ClassName: ABd
  C999 C1014: ClassName: ABc
C73 C983 C1001 C1002 C1015 = CT20-S6220: 22UF;10%;20V;EIA 7343;SMT; Approved: XiaoXiao; NoLoad: .; MFGR: ANY; level: 1; line_number: 270; ModifyDate: 12/03/2012; M_PN: ANY; G_PN: CT20-S6220; Value: 22UF; item_number: CT20-S6220
  C73 C1015: ClassName: ABb
  C983: ClassName: ABa
  C1001: ClassName: ABd
  C1002: ClassName: ABc
C74 C81 C984 C986 C1004 C1005 C1010 C1011 = CK40-05470: NoLoad: .; MFGR: VENKEL; M_PN: C0402X5R6R3-475KNP; level: 1; line_number: 275; ModifyDate: 6/27/13; G_PN: CK40-05470; ClassName: A1-A1; item_number: CK40-05470
C80 C93 C985 C990 C1007 C1008 C1021 C1025 C1026 C1030 = CK50-15470: Approved: CL; NoLoad: .; MFGR: ANY; level: 1; line_number: 280; ModifyDate: 02/26/203; M_PN: ANY; G_PN: CK50-15470; item_number: CK50-15470
  C80 C93 C1021 C1030: ClassName: ABb
  C985 C990: ClassName: ABa
  C1007 C1025: ClassName: ABd
  C1008 C1026: ClassName: ABc
C88 C989 C1019 C1020 C1027 = CK50-04330: Approved: CL; NoLoad: .; MFGR: ANY; level: 1; line_number: 290; G_PN: CK50-04330; ModifyDate: 02/26/13; M_PN: ANY; item_number: CK50-04330
  C88 C1027: ClassName: ABb
  C989: ClassName: ABa
  C1019: ClassName: ABd
  C1020: ClassName: ABc
C89 C993 C1022 C1023 C1028 = CK50-06100: Approved: CL; NoLoad: .; MFGR: ANY; level: 1; line_number: 285; ModifyDate: 4/23/13; M_PN: ANY; G_PN: CK50-06100; item_number: CK50-06100
  C89 C1028: ClassName: ABb
  C993: ClassName: ABa
  C1022: ClassName: ABd
  C1023: ClassName: ABc
C867 = CK41-00001: Approved: CL; NoLoad: .; MFGR: ATC; M_PN: 600L0R1AT200; level: 1; line_number: 284; G_PN: CK41-00001; ModifyDate: 8/19/14; ClassName: A1-A1; item_number: CK41-00001
C870 C960 C997 C1000 = CK41-00004: Approved: CL; NoLoad: .; MFGR: ATC; M_PN: 600L0R4AT200; level: 1; line_number: 160; ModifyDate: 02/14/13; G_PN: CK41-00004; ClassName: FLh; item_number: CK41-00004
C1003 C1006 = CK41-00051: Approved: CL; NoLoad: .; MFGR: ATC; M_PN: 600L5R1BT200; level: 1; line_number: 62; ModifyDate: 4/5/13; G_PN: CK41-00051; ClassName: FLh; item_number: CK41-00051
CR1 CR3-CR5 CR13 = DSA2-00054: MFGR: NXP; M_PN: BAT54S; NoLoad: .; Approved: CL; Value: BAT54S; level: 1; line_number: 320; G_PN: DSA2-00054; ModifyDate: 2/26/13; item_number: DSA2-00054
  CR1: ClassName: ABa
  CR3 CR13: ClassName: ABb
  CR4: ClassName: ABd
  CR5: ClassName: ABc
FL96 FL101 FL103 FL108 FL110 FL115 FL117 FL122 FL126 FL128 = LFS1-00222: 2200 PF FEED THRU FILTER 0603; Value: 2200pF; Approved: NM; MFGR: muRata; NoLoad: .; level: 1; line_number: 475; G_PN: LFS1-00222; ModifyDate: 11/14/12; M_PN: NFM18CC222R1C3; item_number: LFS1-00222
  FL96: ClassName: FLa
  FL101: ClassName: FLb
  FL108: ClassName: FLc
  FL110: ClassName: FLi
  FL115: ClassName: FLd
  FL117: ClassName: FLe
  FL122: ClassName: FLf
  FL126: ClassName: FLg
  FL128: ClassName: FLh
FL97 FL102 FL104 FL109 FL111 FL116 FL118 FL123 FL127 FL129 = LFS0-00222: Approved: CL; NoLoad: .; M_PN: NFE31PT222Z1E9BL; MFGR: MURATA; level: 1; line_number: 335; G_PN: LFS0-00222; ModifyDate: 02/22/12; Value: 2200pF; item_number: LFS0-00222
FT1 FT22 FT25 = FromToNode: level: 1; Approved: *; G_PN: *; MFGR: *; Value: *
L259-L264 = LSA6-02430: M_PN: 0402HP-4N3XJLW; MFGR: COILCRAFT; NoLoad: .; Approved: CL; level: 1; line_number: 247; G_PN: LSA6-02430; ModifyDate: 9/8/14; item_number: LSA6-02430
NT1 NT3 = 3wayT: level: 1
  NT1: ClassName: Aba
  NT3: ClassName: ABd
Q1 = QBNP-00200: Value: MJD200T4; NoLoad: .; Approved: CL; MFGR: ON SEMI; level: 1; line_number: 630; ModifyDate: 02/22/12; G_PN: QBNP-00200; M_PN: MJD200T4; item_number: QBNP-00200
R15 R26 R29 R189 R675 = RK35-21000: Approved: CL; NoLoad: .; MFGR: ANY; level: 1; line_number: 700; G_PN: RK35-21000; ModifyDate: 02/22/12; M_PN: ANY; item_number: RK35-21000
  R15 R189: ClassName: ABb
  R26: ClassName: ABd
  R29: ClassName: ABc
  R675: ClassName: ABa
R18 R35 R36 R190 R677 = RK35-14990: Approved: CL; NoLoad: .; MFGR: ANY; level: 1; line_number: 720; ModifyDate: 4/11/12; M_PN: ANY; G_PN: RK35-14990; item_number: RK35-14990
  R18 R190: ClassName: ABb
  R35: ClassName: ABd
  R36: ClassName: ABc
  R677: ClassName: ABa
R19 R39 R191 = RK35-21330: Approved: CL; NoLoad: .; MFGR: ANY; level: 1; line_number: 885; G_PN: RK35-21330; ModifyDate: 4/30/13; M_PN: ANY; item_number: RK35-21330
  R19 R191: ClassName: ABb
  R39: ClassName: ABc
R21 = RK35-06040: NoLoad: .; Approved: CL; MFGR: ANY; level: 1; line_number: 962; G_PN: RK35-06040; ModifyDate: 4/23/13; M_PN: ANY; ClassName: ABb; item_number: RK35-06040
R24 = RK40-00499: Approved: CL; NoLoad: .; MFGR: ANY; level: 1; line_number: 745; ModifyDate: 4/4/12; G_PN: RK40-00499; M_PN: ANY; item_number: RK40-00499
R25 R47 R48 R261 R681 = RK36-21000: Approved: CL; NoLoad: .; MFGR: VISHAY-DALE; M_PN: CRCW040210K0DHEDP; level: 1; line_number: 750; G_PN: RK36-21000; ModifyDate: 4/23/13; item_number: RK36-21000
  R25 R261: ClassName: ABb
  R47: ClassName: ABd
  R48: ClassName: ABc
  R681: ClassName: ABa
R38 = RK35-21540: Approved: CL; NoLoad: .; MFGR: ANY; level: 1; line_number: 880; G_PN: RK35-21540; ModifyDate: 02/26/13; M_PN: ANY; ClassName: ABd; item_number: RK35-21540
R41 = RK35-03320: NoLoad: .; Approved: CL; MFGR: ANY; level: 1; line_number: 897; G_PN: RK35-03320; ModifyDate: 4/9/12; M_PN: ANY; ClassName: ABd; item_number: RK35-03320
R43 R260 = RK35-04750: NoLoad: .; Approved: CL; MFGR: ANY; level: 1; line_number: 917; G_PN: RK35-04750; ModifyDate: 02/22/12; M_PN: ANY; item_number: RK35-04750
  R43: ClassName: ABc
  R260: ClassName: ABb
R186 R188 = RK30-07500: Approved: CL; NoLoad: .; MFGR: Vishay-Dale; M_PN: CRCW0201750RFKED; level: 1; line_number: 725; G_PN: RK30-07500; ModifyDate: 7/25/13; item_number: RK30-07500
R279 R281 = RK35-00000: NoLoad: .; Approved: CL; MFGR: ANY; level: 1; line_number: 1005; G_PN: RK35-00000; ModifyDate: 02/22/12; M_PN: ANY; ClassName: ABb; item_number: RK35-00000
R328 = RK35-11000: Approved: CL; NoLoad: .; MFGR: ANY; level: 1; line_number: 1025; G_PN: RK35-11000; ModifyDate: 02/22/12; M_PN: ANY; item_number: RK35-11000
R383 R384 = RASA-02200: M_PN: PVA2A221A01; MFGR: PANASONIC; Approved: CL; Value: 200; level: 1; G_PN: RASA-02200; ModifyDate: 2/6/14; item_number: RASA-02200
R678 = RK35-12740: Approved: CL; NoLoad: .; MFGR: ANY; level: 1; line_number: 1010; G_PN: RK35-12740; ModifyDate: 5/10/13; M_PN: ANY; ClassName: ABa; item_number: RK35-12740
R679 = RK35-11210: NoLoad: .; Approved: CL; MFGR: ANY; level: 1; line_number: 1050; G_PN: RK35-11210; ModifyDate: 02/22/13; M_PN: ANY; ClassName: ABa; item_number: RK35-11210
T1 T14-T17 T34-T40 T43 T44 T49 T50 T53-T55 T70-T72 T77-T79 = JIB0-11254: SOCKET;SINGLE;.018-.040 ID X .254;OPEN;GLD; NoLoad: .; MFGR: AMP; Approved: NM; M_PN: 380635; level: 1; line_number: 1065; ModifyDate: 11/30/12; G_PN: JIB0-11254; ClassName: A1-A1; item_number: JIB0-11254
T84 = JIB0-11254_Trim: SOCKET;SINGLE;.018-.040 ID X .254;OPEN;GLD; NoLoad: .; MFGR: AMP; M_PN: 380635; level: 1; line_number: 1065; ModifyDate: 11/30/12; ClassName: A1-A1; item_number: JIB0-11254
TP1 TP3-TP8 TP12-TP14 TP16 TP49 TP50 = TP-060: Approved: NM; level: 1; MFGR: N/A; M_PN: N/A
U30 = ULD0-00920_1: HMC920LP5E ACTIVE BIAS CONTROLLER;1 OUT;16.5V MAX IN;QFN-32; Approved: CL; MFGR: Hittite; NoLoad: .; level: 1; line_number: 1205; ModifyDate: 2/26/2013; M_PN: HMC920LP5E; Value: HMC920LP5E; item_number: ULD0-00920
U38 U64 U77 U78 = ULD0-00920: HMC920LP5E ACTIVE BIAS CONTROLLER;1 OUT;16.5V MAX IN;QFN-32; Approved: CL; MFGR: Hittite; NoLoad: .; level: 1; line_number: 1205; ModifyDate: 2/26/2013; G_PN: ULD0-00920; Value: HMC920LP5E; item_number: ULD0-00920